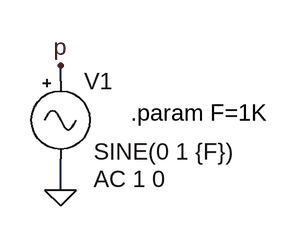
[diagram p0: schematic GenSin.asc]
GenSin.asc, the LTspice schematic file:
Version 4
SHEET 1 880 680
WIRE 32 112 32 96
WIRE 32 224 32 192
FLAG 32 96 p
FLAG 32 224 0
SYMBOL Misc\\signal 32 96 R0
WINDOW 123 34 116 Left 0
WINDOW 39 0 0 Left 0
WINDOW 3 34 88 Left 0
SYMATTR Value2 AC 1 0
SYMATTR InstName V1
SYMATTR Value SINE(0 1 {F})
TEXT 104 144 Left 0 !.param F=1K

The netlist it stands for:
* GenSin.asc
V1 p 0 SINE(0 1 {F}) AC 1 0
.param F=1K
.backanno
.end